# Altium schematic sheet AMS_CAN.SchDoc: CAN
size A4; CheckedBy: Àlex Sánchez i Benet; DrawnBy: Àlex Sánchez i Benet; DocumentNumber: 1; Revision: 1; SheetNumber: 5; SheetTotal: 5; University: UPC EEBE; City: Barcelona; Country: Spain; CP: 08019; Address: Av. Eduard Maristany, 16
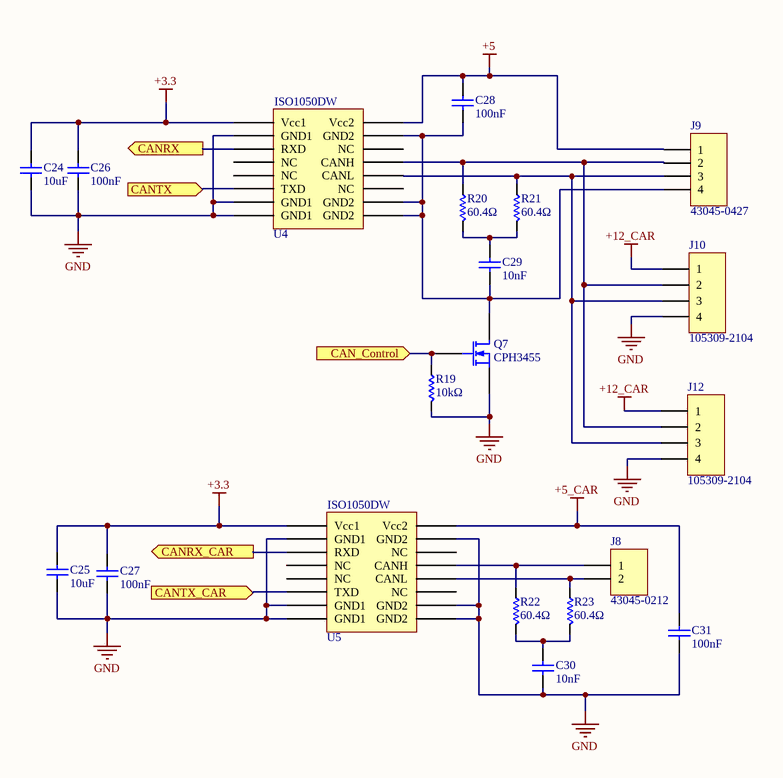
[diagram p0: AMS_CAN.SchDoc]

## Parts
C24  10uF  [0805_2x1.25x1.25mm_Reflow Soldering]
C25  10uF  [0805_2x1.25x1.25mm_Reflow Soldering]
C26  100nF  [0805_2x1.25x0.8mm_Reflow Soldering]
C27  100nF  [0805_2x1.25x0.8mm_Reflow Soldering]
C28  100nF  [0805_2x1.25x0.8mm_Reflow Soldering]
C29  10nF  [0805_2x1.25x0.8mm_Reflow Soldering]
C30  10nF  [0805_2x1.25x0.8mm_Reflow Soldering]
C31  100nF  [0805_2x1.25x0.8mm_Reflow Soldering]
J8  43045-0212  [43045-0212]
J9  43045-0427  [43045-0427]
J10  105309-2104  [105309-2104]
J12  105309-2104  [105309-2104]
Q7  CPH3455  [CPH3455]
R19  10kΩ  [CR0805]
R20  60.4Ω  [CR0805]
R21  60.4Ω  [CR0805]
R22  60.4Ω  [CR0805]
R23  60.4Ω  [CR0805]
U4  ISO1050DW  [ISO1050DW]
U5  ISO1050DW  [ISO1050DW]

## Ports
CAN_Control (in), CANRX (out), CANRX_CAR (out), CANTX (in), CANTX_CAR (in)

## Nets
+3.3: C24.2 C25.2 C26.2 C27.2 U4.1(Vcc1) U5.1(Vcc1)
+5: C28.2 J9.1 U4.16(Vcc2)
+5_CAR: C31.2 U5.16(Vcc2)
+12_CAR: J10.1 J12.1
GND: C24.1 C25.1 C26.1 C27.1 C30.1 C31.1 J10.4 J12.4 Q7.2(S) R19.1 U4.2(GND1) U4.7(GND1) U4.8(GND1) U5.2(GND1) U5.7(GND1) U5.8(GND1) U5.9(GND2) U5.10(GND2) U5.15(GND2)
CAN_Control: Q7.1(G) R19.2 ; port CAN_Control
CANRX: U4.3(RXD) ; port CANRX
CANRX_CAR: U5.3(RXD) ; port CANRX_CAR
CANTX: U4.6(TXD) ; port CANTX
CANTX_CAR: U5.6(TXD) ; port CANTX_CAR
NetC28_1: C28.1 C29.1 J9.4 Q7.3(D) U4.9(GND2) U4.10(GND2) U4.15(GND2)
NetC29_2: C29.2 R20.1 R21.1
NetC30_2: C30.2 R22.1 R23.1
NetJ8_1: J8.1 R22.2 U5.13(CANH)
NetJ8_2: J8.2 R23.2 U5.12(CANL)
NetJ9_2: J9.2 J10.2 J12.2 R20.2 U4.13(CANH)
NetJ9_3: J9.3 J10.3 J12.3 R21.2 U4.12(CANL)

Not connected (* = marked no-connect by the designer): U4 4(NC) 5(NC) 11(NC) 14(NC); U5 4(NC) 5(NC) 11(NC) 14(NC)

## Notes on the sheet
- Title
- e-Tech Racing
- UPC EEBE
- Size:
- Date:
- Drawn by:
- A4
- Number:
- Time:
- Revision:
- Sheet
- of
- Av. Eduard Maristany, 16
- 08019
- Barcelona Spain
- Made with:
- Checked by:

## Library data of the parts
C24 C25 = 885012107014: WCAP-CSGP Ceramic Capacitors, 0805, X5R, 16V, 10uF; Rated Voltage: 16V DC; ComponentLink1Description: Manufacturer; ComponentLink1URL: http://www.we-online.de; ComponentLink2Description: Datasheet; ComponentLink2URL: http://katalog.we-online.de/pbs/datasheet/885012107014.pdf; Part Number: 885012107014; Published Date: Oct. 2017; Publisher: Wurth Elektronik; Size: 0805; Operating Temperature: -55 °C to +125 °C; Value: 10uF; Ceramic Type: X5R
C26-C28 C31 = 885012207098: WCAP-CSGP Ceramic Capacitors, 0805, X7R, 50V, 100nF; Rated Voltage: 50V DC; ComponentLink1Description: Manufacturer; ComponentLink1URL: http://www.we-online.de; ComponentLink2Description: Datasheet; ComponentLink2URL: http://katalog.we-online.de/pbs/datasheet/885012207098.pdf; Part Number: 885012207098; Publisher: Wurth Elektronik; Size: 0805; Operating Temperature: -55 °C to +125 °C; Value: 100nF; Ceramic Type: X7R
C29 C30 = 885012207092: WCAP-CSGP Ceramic Capacitors, 0805, X7R, 50V, 10nF; Rated Voltage: 50V DC; ComponentLink1Description: Manufacturer; ComponentLink1URL: http://www.we-online.de; ComponentLink2Description: Datasheet; ComponentLink2URL: http://katalog.we-online.de/pbs/datasheet/885012207092.pdf; Part Number: 885012207092; Publisher: Wurth Elektronik; Size: 0805; Operating Temperature: -55 °C to +125 °C; Value: 10nF; Ceramic Type: X7R
J8 = 43045-0212: Micro-Fit 3.0 Vertical Header, 3.00mm Pitch, Dual Row, 2 Circuits, Black; Manufacturer: Molex; Rated Voltage: 600V DC; Rated Current: 8.5A; Number of Row: 1; Circuits: 2; Operating Temperature: -40° to +105°C; ComponentLink1Description: Datasheet; ComponentLink1URL: https://www.molex.com/webdocs/datasheets/pdf/en-us/0430450212_PCB_HEADERS.pdf
J9 = 43045-0427: Micro-Fit 3.0 Vertical Header, 3.00mm Pitch, Dual Row, 4 Circuits, Black; Manufacturer: Molex; Rated Voltage: 600V DC; Rated Current: 8.5A; Circuits: 4; Operating Temperature: -40° to +105°C; Number of Rows: 2; ComponentLink1Description: Datasheet; ComponentLink1URL: https://www.molex.com/webdocs/datasheets/pdf/en-us/0430450427_PCB_HEADERS.pdf
J10 J12 = 105309-2104: Nano-Fit Vertical Header, Through Hole, 2.50mm Pitch, Single Row, 4 Circuits, Natural; Manufacturer: Molex; Rated Voltage: 250V DC; Rated Current: 6.5A; Operating Temperature: -40° to +105°C; ComponentLink1Description: Datasheet; ComponentLink1URL: https://www.molex.com/pdm_docs/sd/1053092104_sd.pdf
Q7 = CPH3455: Power MOSFET 35V, 104mΩ, 3A, Single N-Channel; Manufacturer: ON Semiconductors; ComponentLink1Description: Datasheet; ComponentLink1URL: https://www.onsemi.com/pub/Collateral/CPH3455-D.PDF
R19 = CR0805-JW-103ELF: Chip Resistor 0805; Manufacturer: Bourns; ComponentLink1Description: Datasheet; ComponentLink1URL: https://www.bourns.com/docs/product-datasheets/chpreztr.pdf?sfvrsn=566c91f1_11
R20-R23 = ERA6AEB60R4V: Chip Resistor 0805; Manufacturer: Panasonic; ComponentLink1Description: Datasheet; ComponentLink1URL: https://www.bourns.com/docs/product-datasheets/chpreztr.pdf?sfvrsn=566c91f1_11
U4 U5 = ISO1050DW: Galvanically isolated CAN / transceiver; Manufacturer: Texas Instruments; Pins: 16; ComponentLink1Description: Datasheet; ComponentLink1URL: http://www.ti.com/lit/ds/symlink/iso1050.pdf